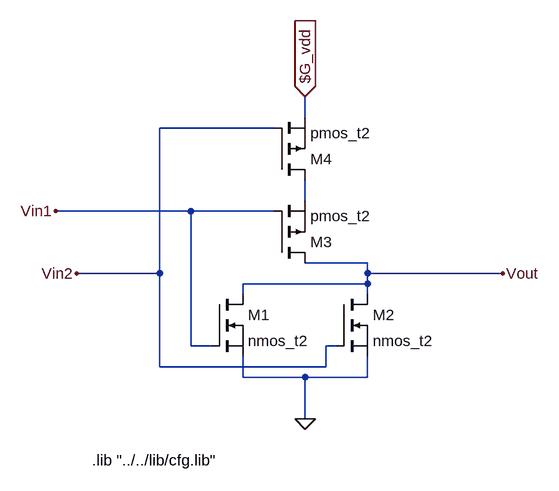
[diagram p0: schematic NOR_2.asc]
NOR_2.asc, the LTspice schematic file:
Version 4
SHEET 1 880 680
WIRE 288 -80 288 -112
WIRE 240 -64 64 -64
WIRE 288 48 288 16
WIRE 112 64 -96 64
WIRE 240 64 112 64
WIRE 384 144 288 144
WIRE 64 160 64 -64
WIRE 64 160 -64 160
WIRE 384 160 384 144
WIRE 592 160 384 160
WIRE 384 176 384 160
WIRE 384 176 192 176
WIRE 192 192 192 176
WIRE 384 192 384 176
WIRE 112 272 112 64
WIRE 144 272 112 272
WIRE 336 272 320 272
WIRE 64 304 64 160
WIRE 320 304 320 272
WIRE 320 304 64 304
WIRE 192 320 192 288
WIRE 288 320 192 320
WIRE 384 320 384 288
WIRE 384 320 288 320
WIRE 288 384 288 320
FLAG 288 384 0
FLAG 592 160 Vout
FLAG -64 160 Vin2
FLAG 288 -112 $G_vdd
IOPIN 288 -112 In
FLAG -96 64 Vin1
SYMBOL nmos 144 192 R0
SYMATTR InstName M1
SYMATTR Value nmos_t2
SYMATTR Prefix X
SYMBOL nmos 336 192 R0
SYMATTR InstName M2
SYMATTR Value nmos_t2
SYMATTR Prefix X
SYMBOL pmos 240 144 M180
SYMATTR InstName M3
SYMATTR Value pmos_t2
SYMATTR Prefix X
SYMBOL pmos 240 16 M180
SYMATTR InstName M4
SYMATTR Value pmos_t2
SYMATTR Prefix X
TEXT -40 448 Left 2 !.lib "../../lib/cfg.lib"

The netlist it stands for:
* NOR_2.asc
XM1 Vout Vin1 0 nmos_t2  ; pins D G S
XM2 Vout Vin2 0 nmos_t2  ; pins D G S
XM3 Vout Vin1 N001 pmos_t2  ; pins D G S
XM4 N001 Vin2 $G_vdd pmos_t2  ; pins D G S
.lib "../../lib/cfg.lib"
.backanno
.end